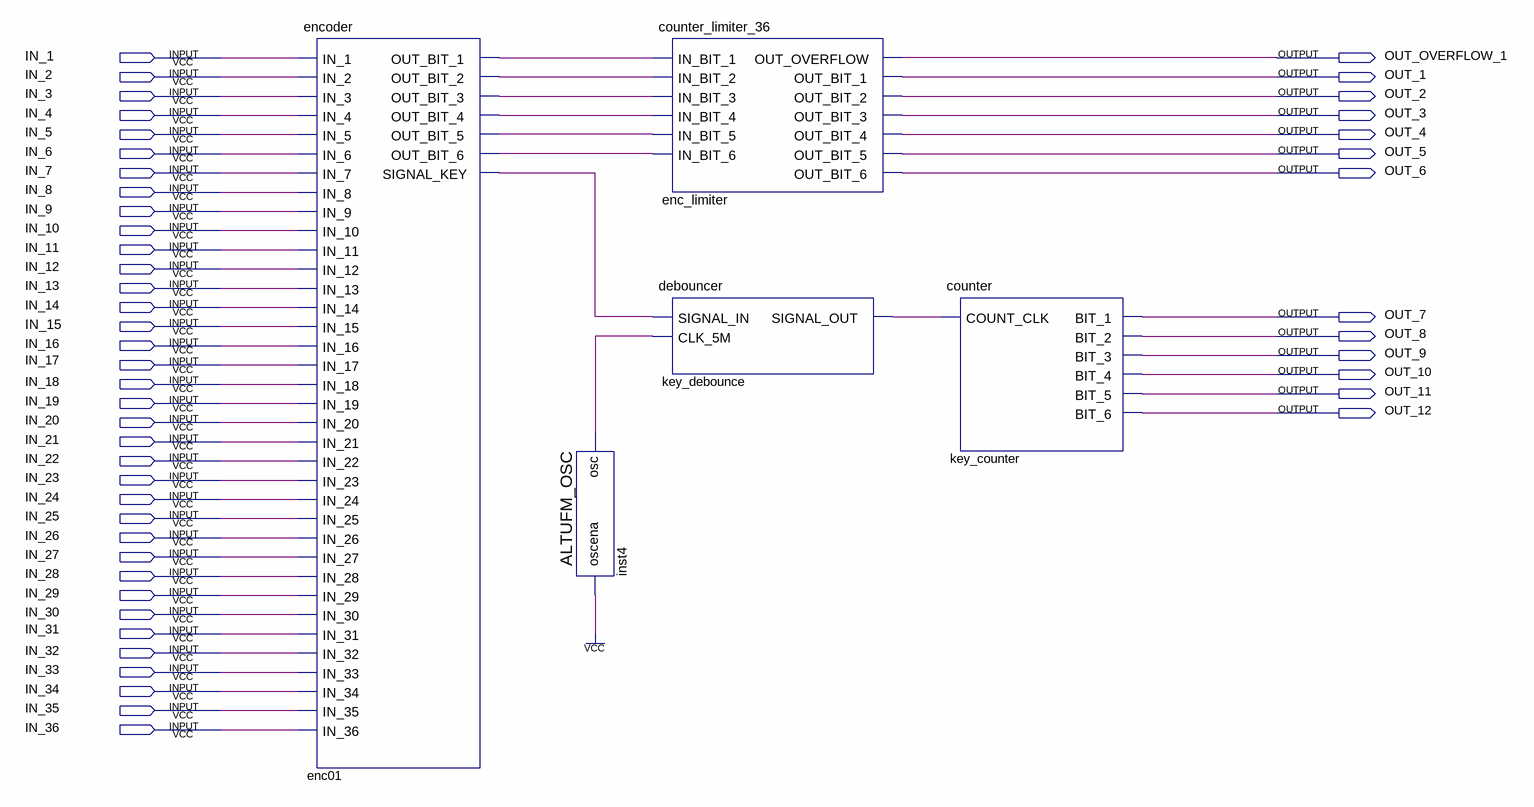
[diagram p0: schematic sheet]
// Quartus schematic mux_rom_demux.bdf as structural Verilog: 5 symbols, 49 pins
module mux_rom_demux (
  input  IN_1,
  input  IN_2,
  input  IN_3,
  input  IN_4,
  input  IN_5,
  input  IN_6,
  input  IN_7,
  input  IN_8,
  input  IN_9,
  input  IN_10,
  input  IN_11,
  input  IN_12,
  input  IN_13,
  input  IN_14,
  input  IN_15,
  input  IN_16,
  input  IN_17,
  input  IN_18,
  input  IN_19,
  input  IN_20,
  input  IN_21,
  input  IN_22,
  input  IN_23,
  input  IN_24,
  input  IN_25,
  input  IN_26,
  input  IN_27,
  input  IN_28,
  input  IN_29,
  input  IN_30,
  input  IN_31,
  input  IN_32,
  input  IN_33,
  input  IN_34,
  input  IN_35,
  input  IN_36,
  output OUT_OVERFLOW_1,
  output OUT_1,
  output OUT_2,
  output OUT_3,
  output OUT_4,
  output OUT_5,
  output OUT_6,
  output OUT_7,
  output OUT_8,
  output OUT_9,
  output OUT_10,
  output OUT_11,
  output OUT_12
);

  wire enc01_out_bit_1, enc01_out_bit_2, enc01_out_bit_3, enc01_out_bit_4, enc01_out_bit_5, enc01_out_bit_6,
       enc01_signal_key, inst4_osc, key_debounce_signal_out;

  encoder enc01 (
    .IN_1(IN_1), .IN_2(IN_2), .IN_3(IN_3), .IN_4(IN_4), .IN_5(IN_5), .IN_6(IN_6), .IN_7(IN_7), .IN_8(IN_8),
    .IN_9(IN_9), .IN_10(IN_10), .IN_11(IN_11), .IN_12(IN_12), .IN_13(IN_13), .IN_14(IN_14), .IN_15(IN_15),
    .IN_16(IN_16), .IN_17(IN_17), .IN_18(IN_18), .IN_19(IN_19), .IN_20(IN_20), .IN_21(IN_21), .IN_22(IN_22),
    .IN_23(IN_23), .IN_24(IN_24), .IN_25(IN_25), .IN_26(IN_26), .IN_27(IN_27), .IN_28(IN_28), .IN_29(IN_29),
    .IN_30(IN_30), .IN_31(IN_31), .IN_32(IN_32), .IN_33(IN_33), .IN_34(IN_34), .IN_35(IN_35), .IN_36(IN_36),
    .OUT_BIT_1(enc01_out_bit_1), .OUT_BIT_2(enc01_out_bit_2), .OUT_BIT_3(enc01_out_bit_3),
    .OUT_BIT_4(enc01_out_bit_4), .OUT_BIT_5(enc01_out_bit_5), .OUT_BIT_6(enc01_out_bit_6),
    .SIGNAL_KEY(enc01_signal_key));
  ALTUFM_OSC #(.OSC_FREQUENCY(136000)) inst4 (.oscena(1'b1), .osc(inst4_osc));
  counter_limiter_36 enc_limiter (
    .IN_BIT_1(enc01_out_bit_1), .IN_BIT_2(enc01_out_bit_2), .IN_BIT_3(enc01_out_bit_3),
    .IN_BIT_4(enc01_out_bit_4), .IN_BIT_5(enc01_out_bit_5), .IN_BIT_6(enc01_out_bit_6),
    .OUT_OVERFLOW(OUT_OVERFLOW_1), .OUT_BIT_1(OUT_1), .OUT_BIT_2(OUT_2), .OUT_BIT_3(OUT_3),
    .OUT_BIT_4(OUT_4), .OUT_BIT_5(OUT_5), .OUT_BIT_6(OUT_6));
  debouncer key_debounce (.SIGNAL_IN(enc01_signal_key), .CLK_5M(inst4_osc), .SIGNAL_OUT(key_debounce_signal_out));
  counter key_counter (
    .COUNT_CLK(key_debounce_signal_out), .BIT_1(OUT_7), .BIT_2(OUT_8), .BIT_3(OUT_9), .BIT_4(OUT_10),
    .BIT_5(OUT_11), .BIT_6(OUT_12));
endmodule
